# Altium project 4 laba.PrjPcb
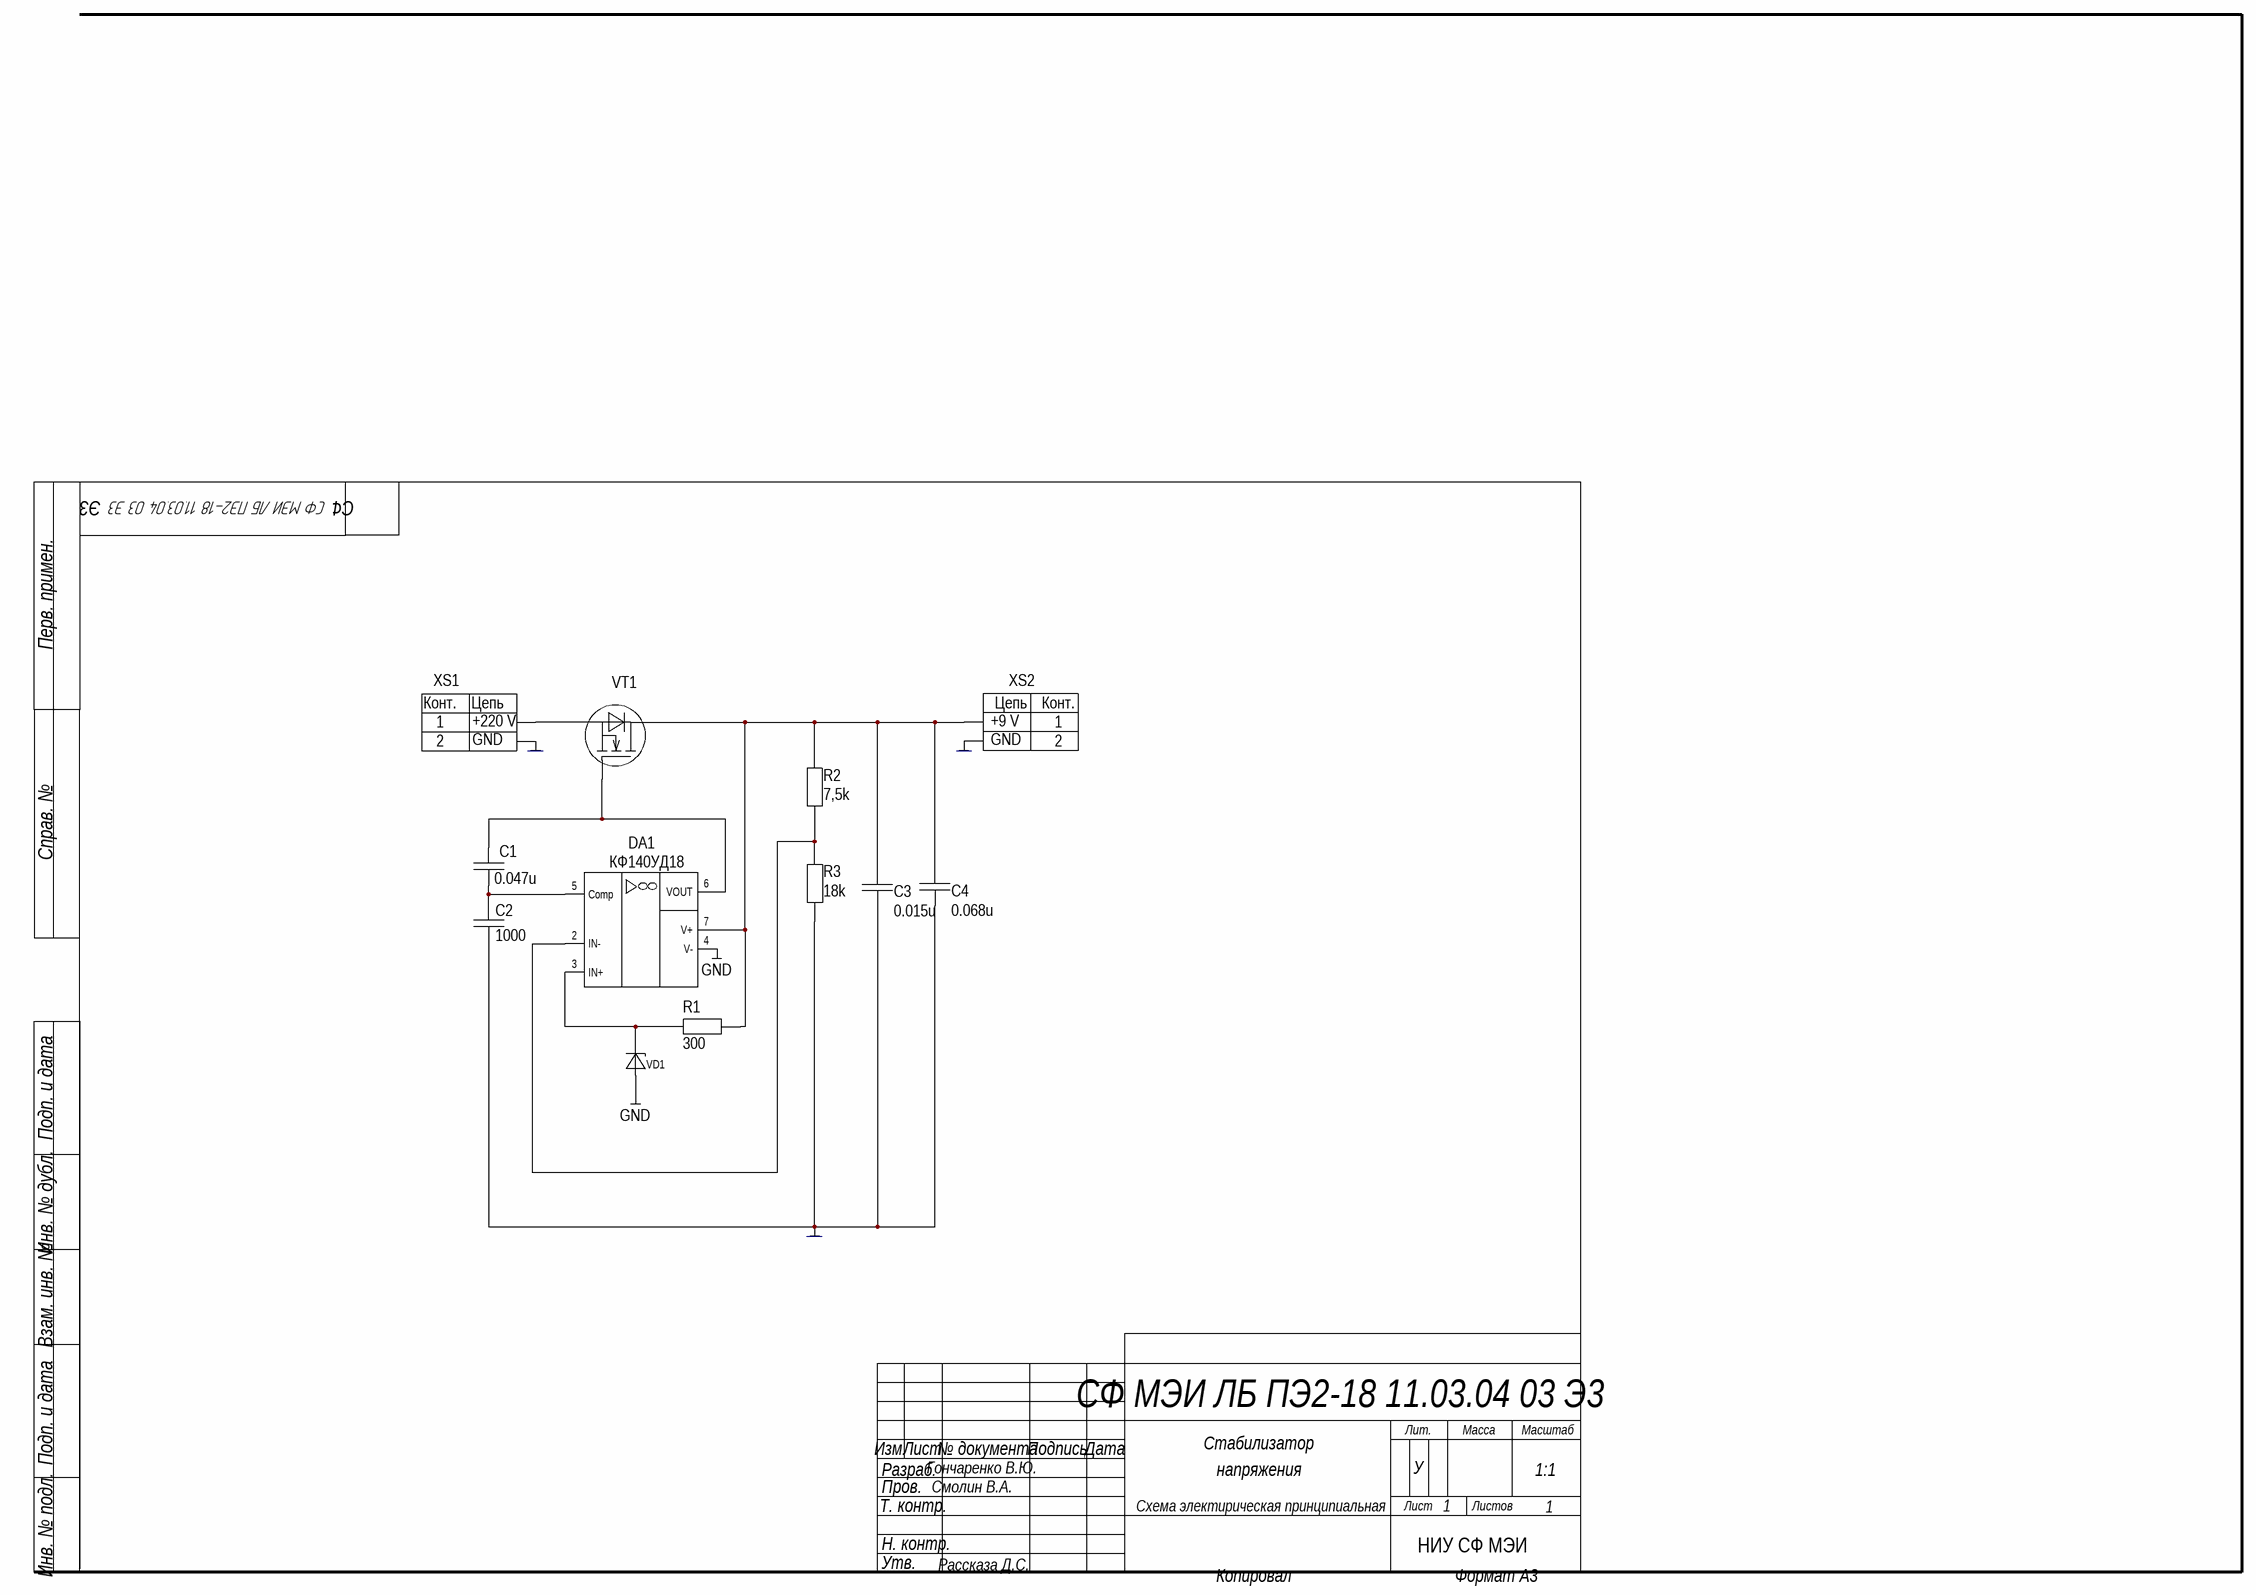
[diagram p0: СФ МЭИ ЛБ ПЭ2-18 11.03.04 03 Э3.SchDoc]
#NAME?: Гончаренко В.Ю.; Децимальный номер печатного узла: СФ МЭИ ЛБ ПЭ2-18 11.03.04 03; Компания: НИУ СФ МЭИ ПЭ2-18; Наименование: Стабилизатор Напряжения; Наименование1: Стабилизатор; Наименование2: Напряжения; Обозначение: СФ МЭИ ЛБ ПЭ2-18 11.03.04 03; Проверил: Смолин В.А.; Разработал: Гончаренко В.Ю.; Утвердил: Рассказа Д.С.
7 sheets, 12 parts. Net scope: global (net labels, ports and power ports of the same name join across sheets).
Board file: СФ МЭИ ЛБ ПЭ2-18 11.03.04 03.PcbDoc
Sheets:
  СФ МЭИ ЛБ ПЭ2-18 11.03.04 03 Э3.SchDoc
  Сборочный.SchDoc
  Плата печатная А3.SchDoc
  ДОРОГА а3.SchDoc
  з маски а3.SchDoc
  П МАСКИ а3.SchDoc
  верхний слой маркировки а3.SchDoc

## Sheet СФ МЭИ ЛБ ПЭ2-18 11.03.04 03 Э3.SchDoc
size 420 x 297 mm; Scale: 1:1; Разраб.: Гончаренко В.Ю.; Пров.: Смолин В.А.; Номер листа: 1; Общее количество листов: 1; Наименование изделия 1: Стабилизатор напряжения; Наименование изделия 2: Схема электрическая; Наименование изделия 3: принципиальная; Нач. отд.: Нач. отд.; Децимальный номер: СФ МЭИ ЛБ ПЭ2-18 11.03.04 03 Э3; Наименование. Строка 2: напряжения; Наименование. Строка 3: Схема электирическая принципиальная; Наименование. Строка 1: Стабилизатор; Разработал: Гончаренко В.Ю.; Проверил: Смолин В.А.; Утвердил: Рассказа Д.С.; Литера: У; Масштаб: 1:1; Лист. Номер: 1; Лист. Всего: 1

### Parts
C1  0.047u  [0805]
C2  1000  [0805]
C3  0.015u  [0805]
C4  0.068u  [0805]
DA1  КФ140УД18  [SOIC-8]
R1  300  [0805]
R2  7,5k  [0805]
R3  18k  [0805]
VD1  MMSZ5235B  [SOD-123]  (value not drawn)
VT1  IRLML2402TRPBF  [SOT23]  (value not drawn)
XS1  DG126-5.0-0.2P  [DG126-5.0-02P]  (value not drawn)
XS2  DG126-5.0-0.2P  [DG126-5.0-02P]  (value not drawn)

### Nets
GND: DA1.4(V-) VD1.1(In)
NetC2_1: C2.1 C3.2 C4.1 R3.1 XS1.2(Pin2) XS2.2(Pin2)
NetC1_1: C1.1 C2.2 DA1.5(Comp)
NetC1_2: C1.2 DA1.6(VOUT) VT1.1(G)
NetC3_1: C3.1 C4.2 DA1.7(V+) R1.2 R2.2 VT1.3(D) XS2.1(Pin1)
NetDA1_2: DA1.2(IN-) R2.1 R3.2
NetDA1_3: DA1.3(IN+) R1.1 VD1.2(Out)
NetVT1_2: VT1.2(S) XS1.1(Pin1)

### Notes on the sheet
- (near XS1) +220 V
- (near XS2) +9 V
- (near XS1) GND
- (near XS2) GND
- НИУ СФ МЭИ ПЭ2-18
- Перв. примен.
- Справ. №
- Подп. и дата
- Инв. № дубл.
- Взам. инв. №
- Разраб.
- Изм.
- Лист
- № документа
- Подпись
- Дата
- Лит.
- Масса
- Масштаб
- Т. контр.
- Пров.
- Листов
- Инв. № подл.
- Н. контр.
- Утв.
- Копировал
- Формат A3
- (in symbol DG126-5.0-0.2P) Конт.; Цепь

### Library data of the parts
C1 = К53-68"R"-25В-0.047 мкФ ±10% 0805_3: К53-68"R"-25В-0.047 мкФ ±10%
C2 = К53-68"R"-25В-1000 пФ ±10% 0805_2: К53-68"R"-25В-1000 пФ ±10%
C3 = К53-68"R"-25В-0.015 мкФ ±10% 0805_1: К53-68"R"-25В-0.015 мкФ ±10%
C4 = К53-68"R"-25В-0.068 мкФ ±10% 0805: К53-68"R"-25В-0.068 мкФ ±10%
R1 = 0.125Вт 0805 300 Ом, 5%, Чип резистор (SMD): 0805-0.125 Вт -300 Ом±5%
R2 = 0.125Вт 0805 7,5 кОм, 5%, Чип резистор (SMD): 0805-0.125 Вт -7,5 кОм±5%
R3 = 0.125Вт 0805 18 кОм, 5%, Чип резистор (SMD): 0805-0.125 Вт -18 кОм±5%
VT1 = IRLML2402TRPBF: SI2304DDS-T1-GE3

## Sheet Сборочный.SchDoc
size 594 x 420 mm; Scale: 1:1; Разраб.: Гончаренко В.Ю.; Пров.: Смолин В.А.; Номер листа: 1; Общее количество листов: 1; Наименование изделия 1: Цифровой автомат; Наименование изделия 2: Сборочный чертеж; Нач. отд.: Нач. отд.; Децимальный номер: СФ МЭИ КР ПЭ2-18 11.03.04 03 СБ; Наименование. Строка 2: Автомат; Наименование. Строка 3: Сборочный чертёж; Наименование. Строка 1: Циффровой; Разработал: Гончаренко В.Ю.; Проверил: Смолин В.А.; Утвердил: Рассказа Д.С.; Литера: У; Масштаб: 3.5:1; Лист. Номер: 1; Лист. Всего: 1
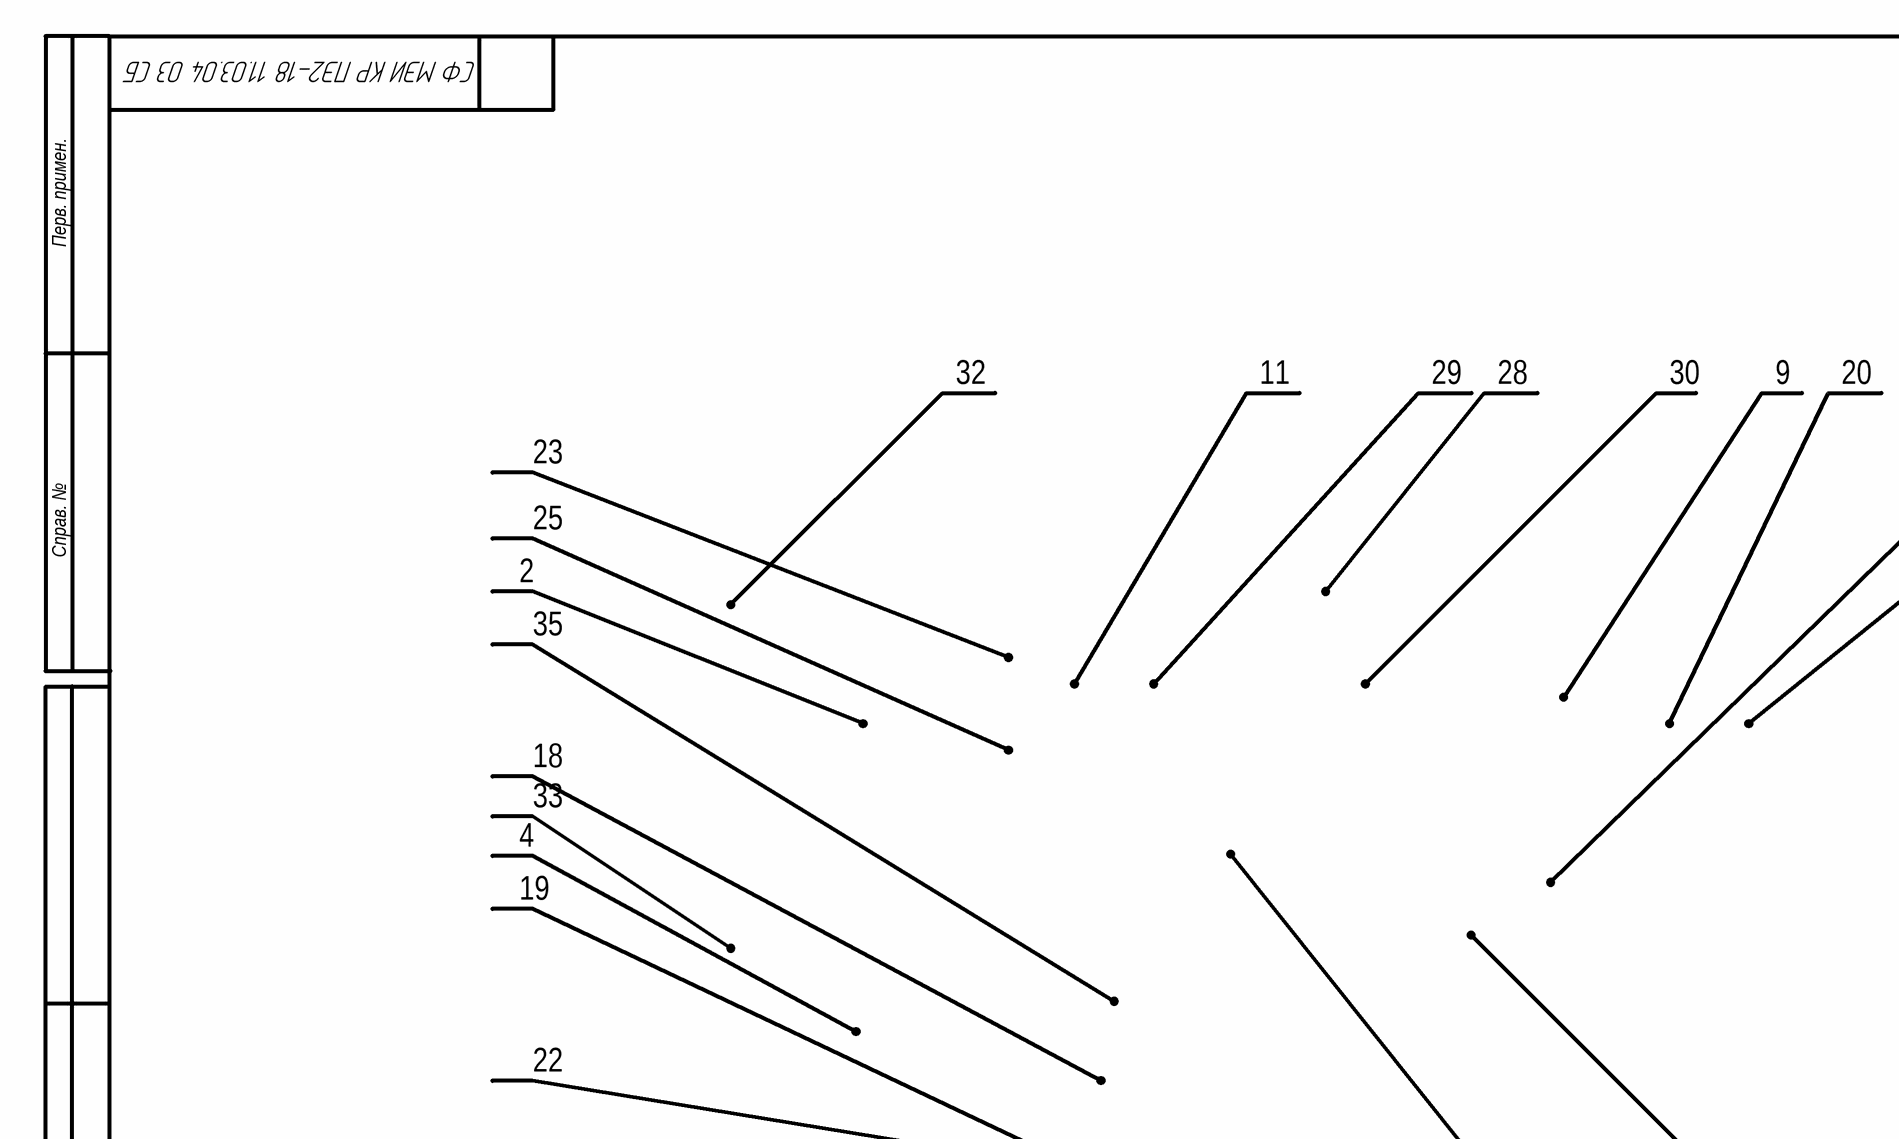
[diagram p1: Сборочный.SchDoc, top left]
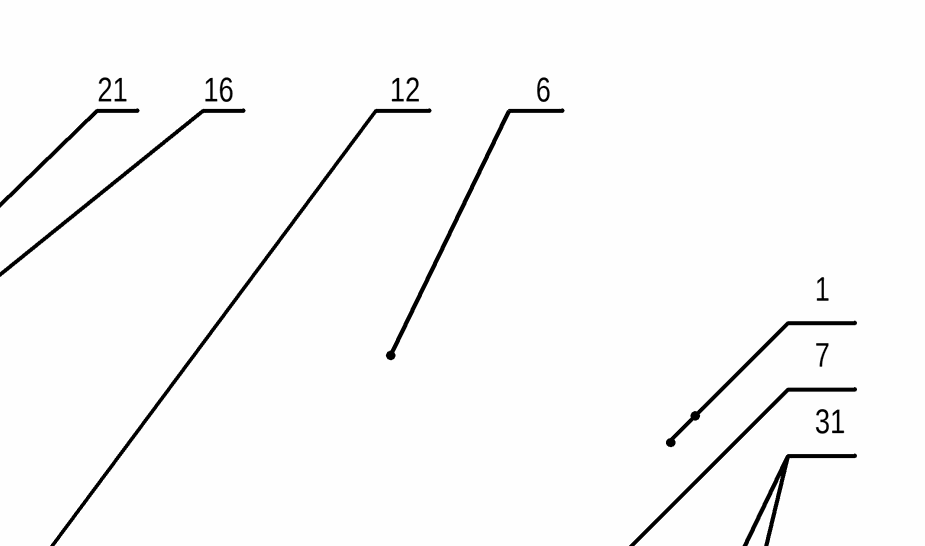
[diagram p2: Сборочный.SchDoc, top right]
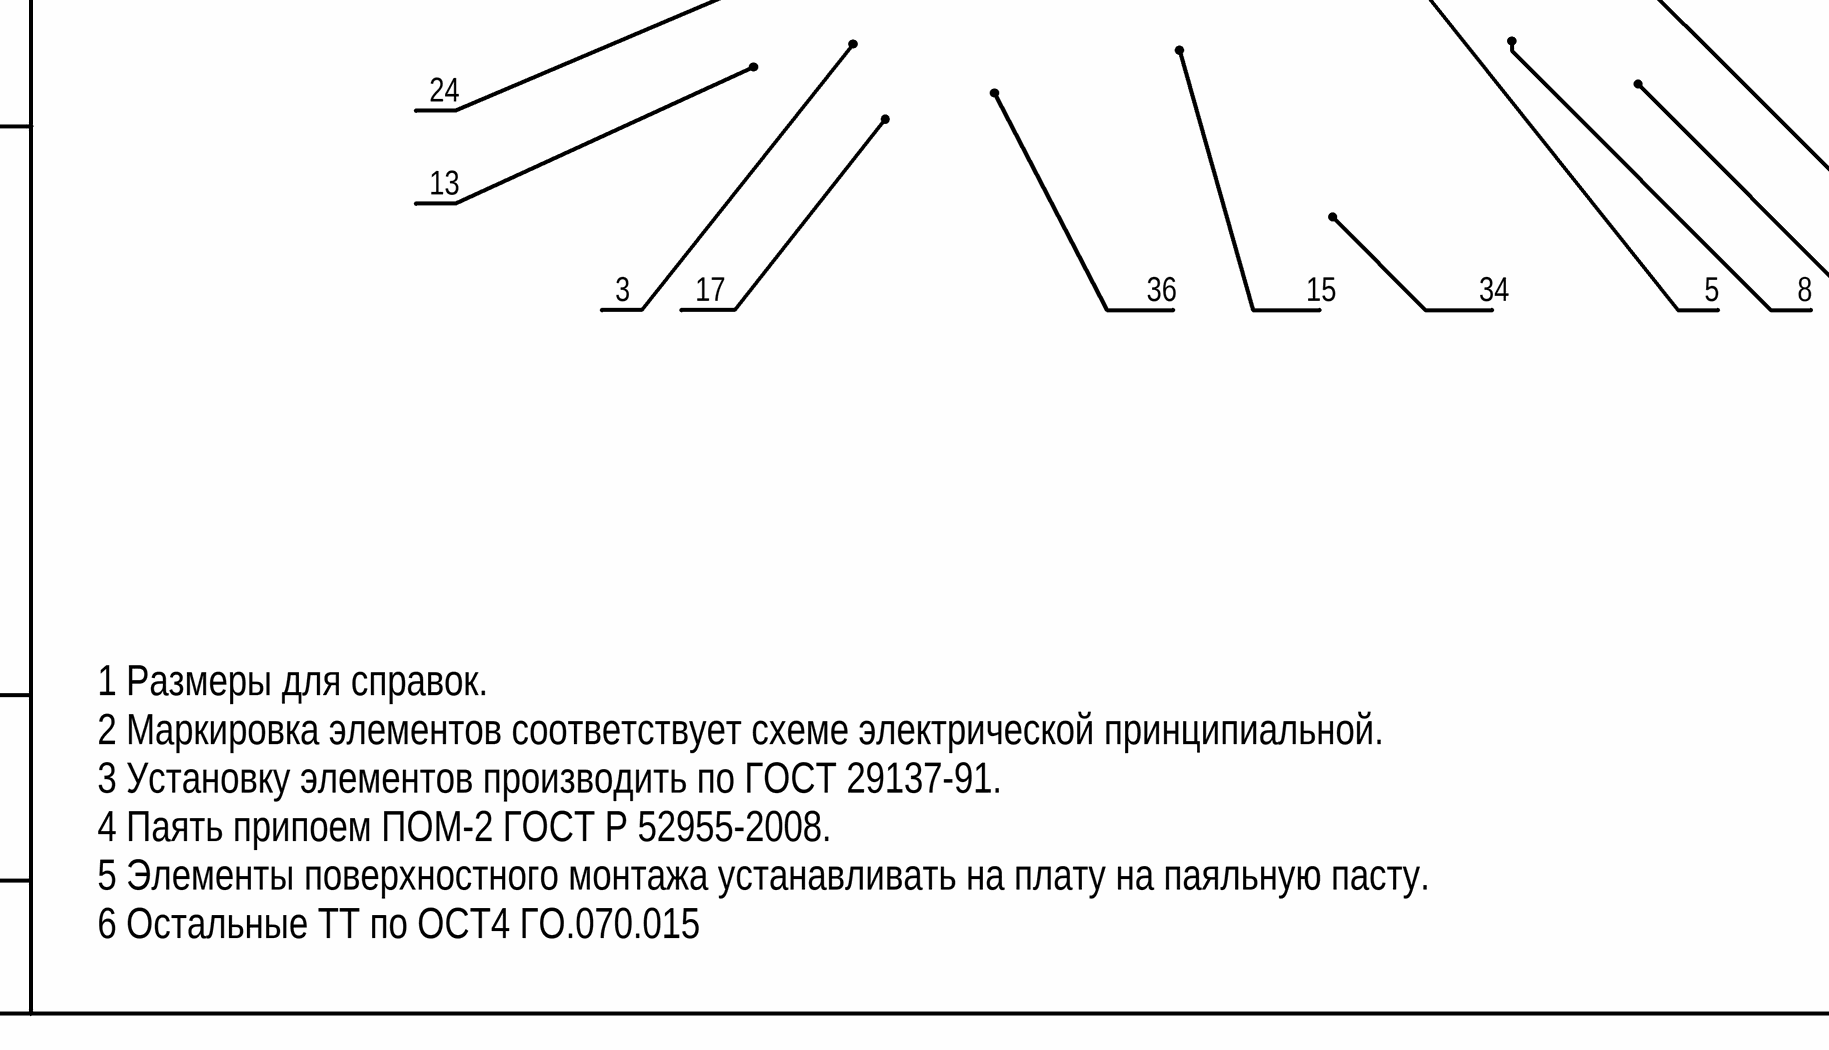
[diagram p3: Сборочный.SchDoc, bottom left]
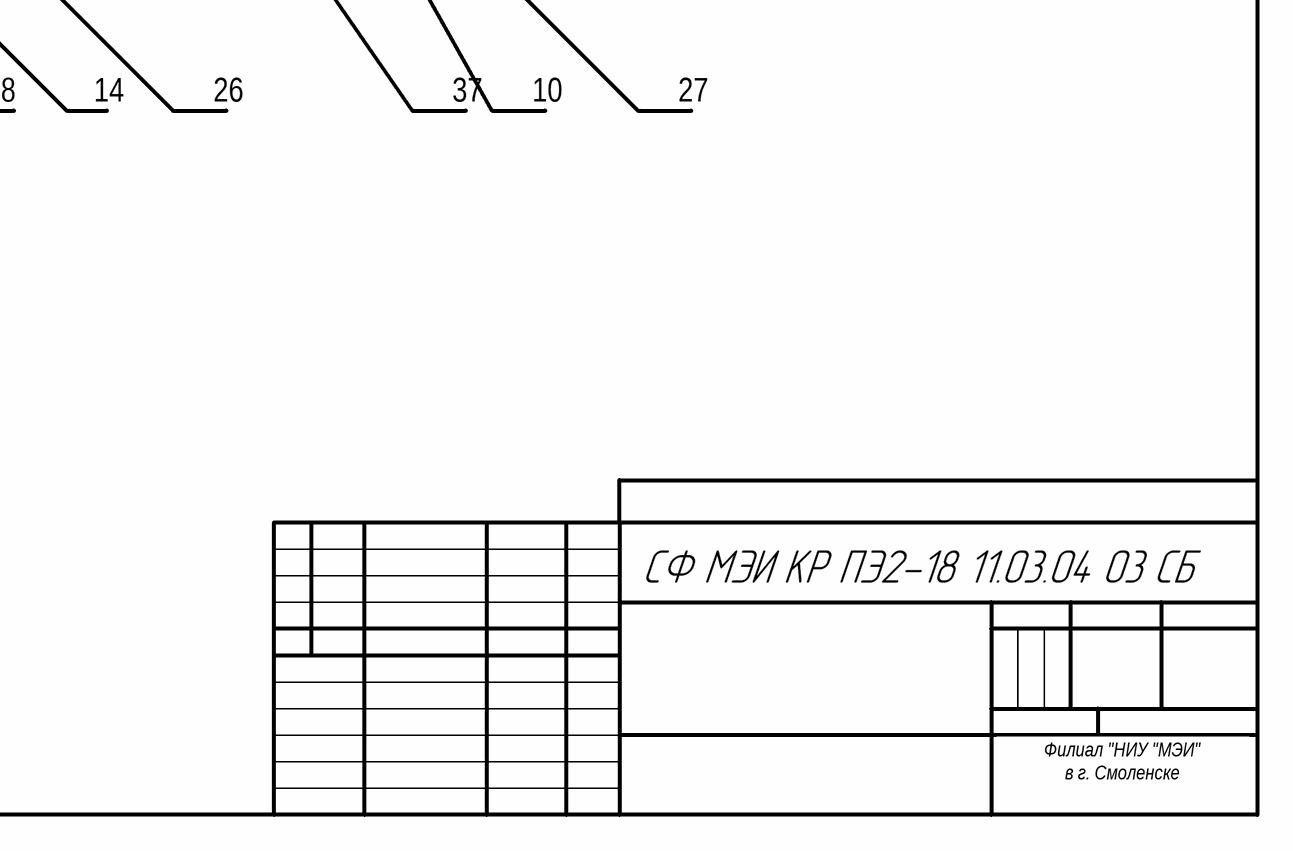
[diagram p4: Сборочный.SchDoc, bottom right]

### Notes on the sheet
- Перв. примен.
- 32
- 11
- 29
- 28
- 30
- 9
- 20
- 21
- 16
- 12
- 6
- 23
- Справ. №
- 25
- 2
- 35
- 1
- 7
- 18
- 31
- 33
- 4
- 19
- 22
- 24
- 13
- 3
- 17
- 36
- 15
- 34
- 5
- 8
- 14
- 26
- 37
- 10
- 27
- 1 Размеры для справок.
  2 Маркировка элементов соответствует схеме электрической принципиальной.
  3 Установку элементов производить по ГОСТ 29137-91.
  4 Паять припоем ПОМ-2 ГОСТ Р 52955-2008.
  5 Элементы поверхностного монтажа устанавливать на плату на паяльную пасту.
  6 Остальные ТТ по ОСТ4 ГО.070.015
- Филиал "НИУ "МЭИ"
  в г. Смоленске
  ПЭ2-18
- Разработал. Дата
- Подп. и дата
- Инв. № дубл.
- Взам. инв. №
- Разраб.
- Изм.
- Лист
- № документа
- Подпись
- Дата
- Лит.
- Масса
- Масштаб
- Т. контр.
- Пров.
- Листов
- Инв. № подл.
- Н. контр.
- Утв.
- Копировал
- Формат A2

## Sheet Плата печатная А3.SchDoc
size 420 x 297 mm; Scale: 1:1; Разраб.: Гончаренко В.Ю.; Пров.: Смолин В.А.; Номер листа: 1; Общее количество листов: 5; Децимальный номер: СФ МЭИ КР ПЭ2-18 11.03.04 03; Разработал: Гончаренко В.Ю.; Проверил: Смолин В.А.; Литера: У; Масштаб: 2:1; Лист. Номер: 1
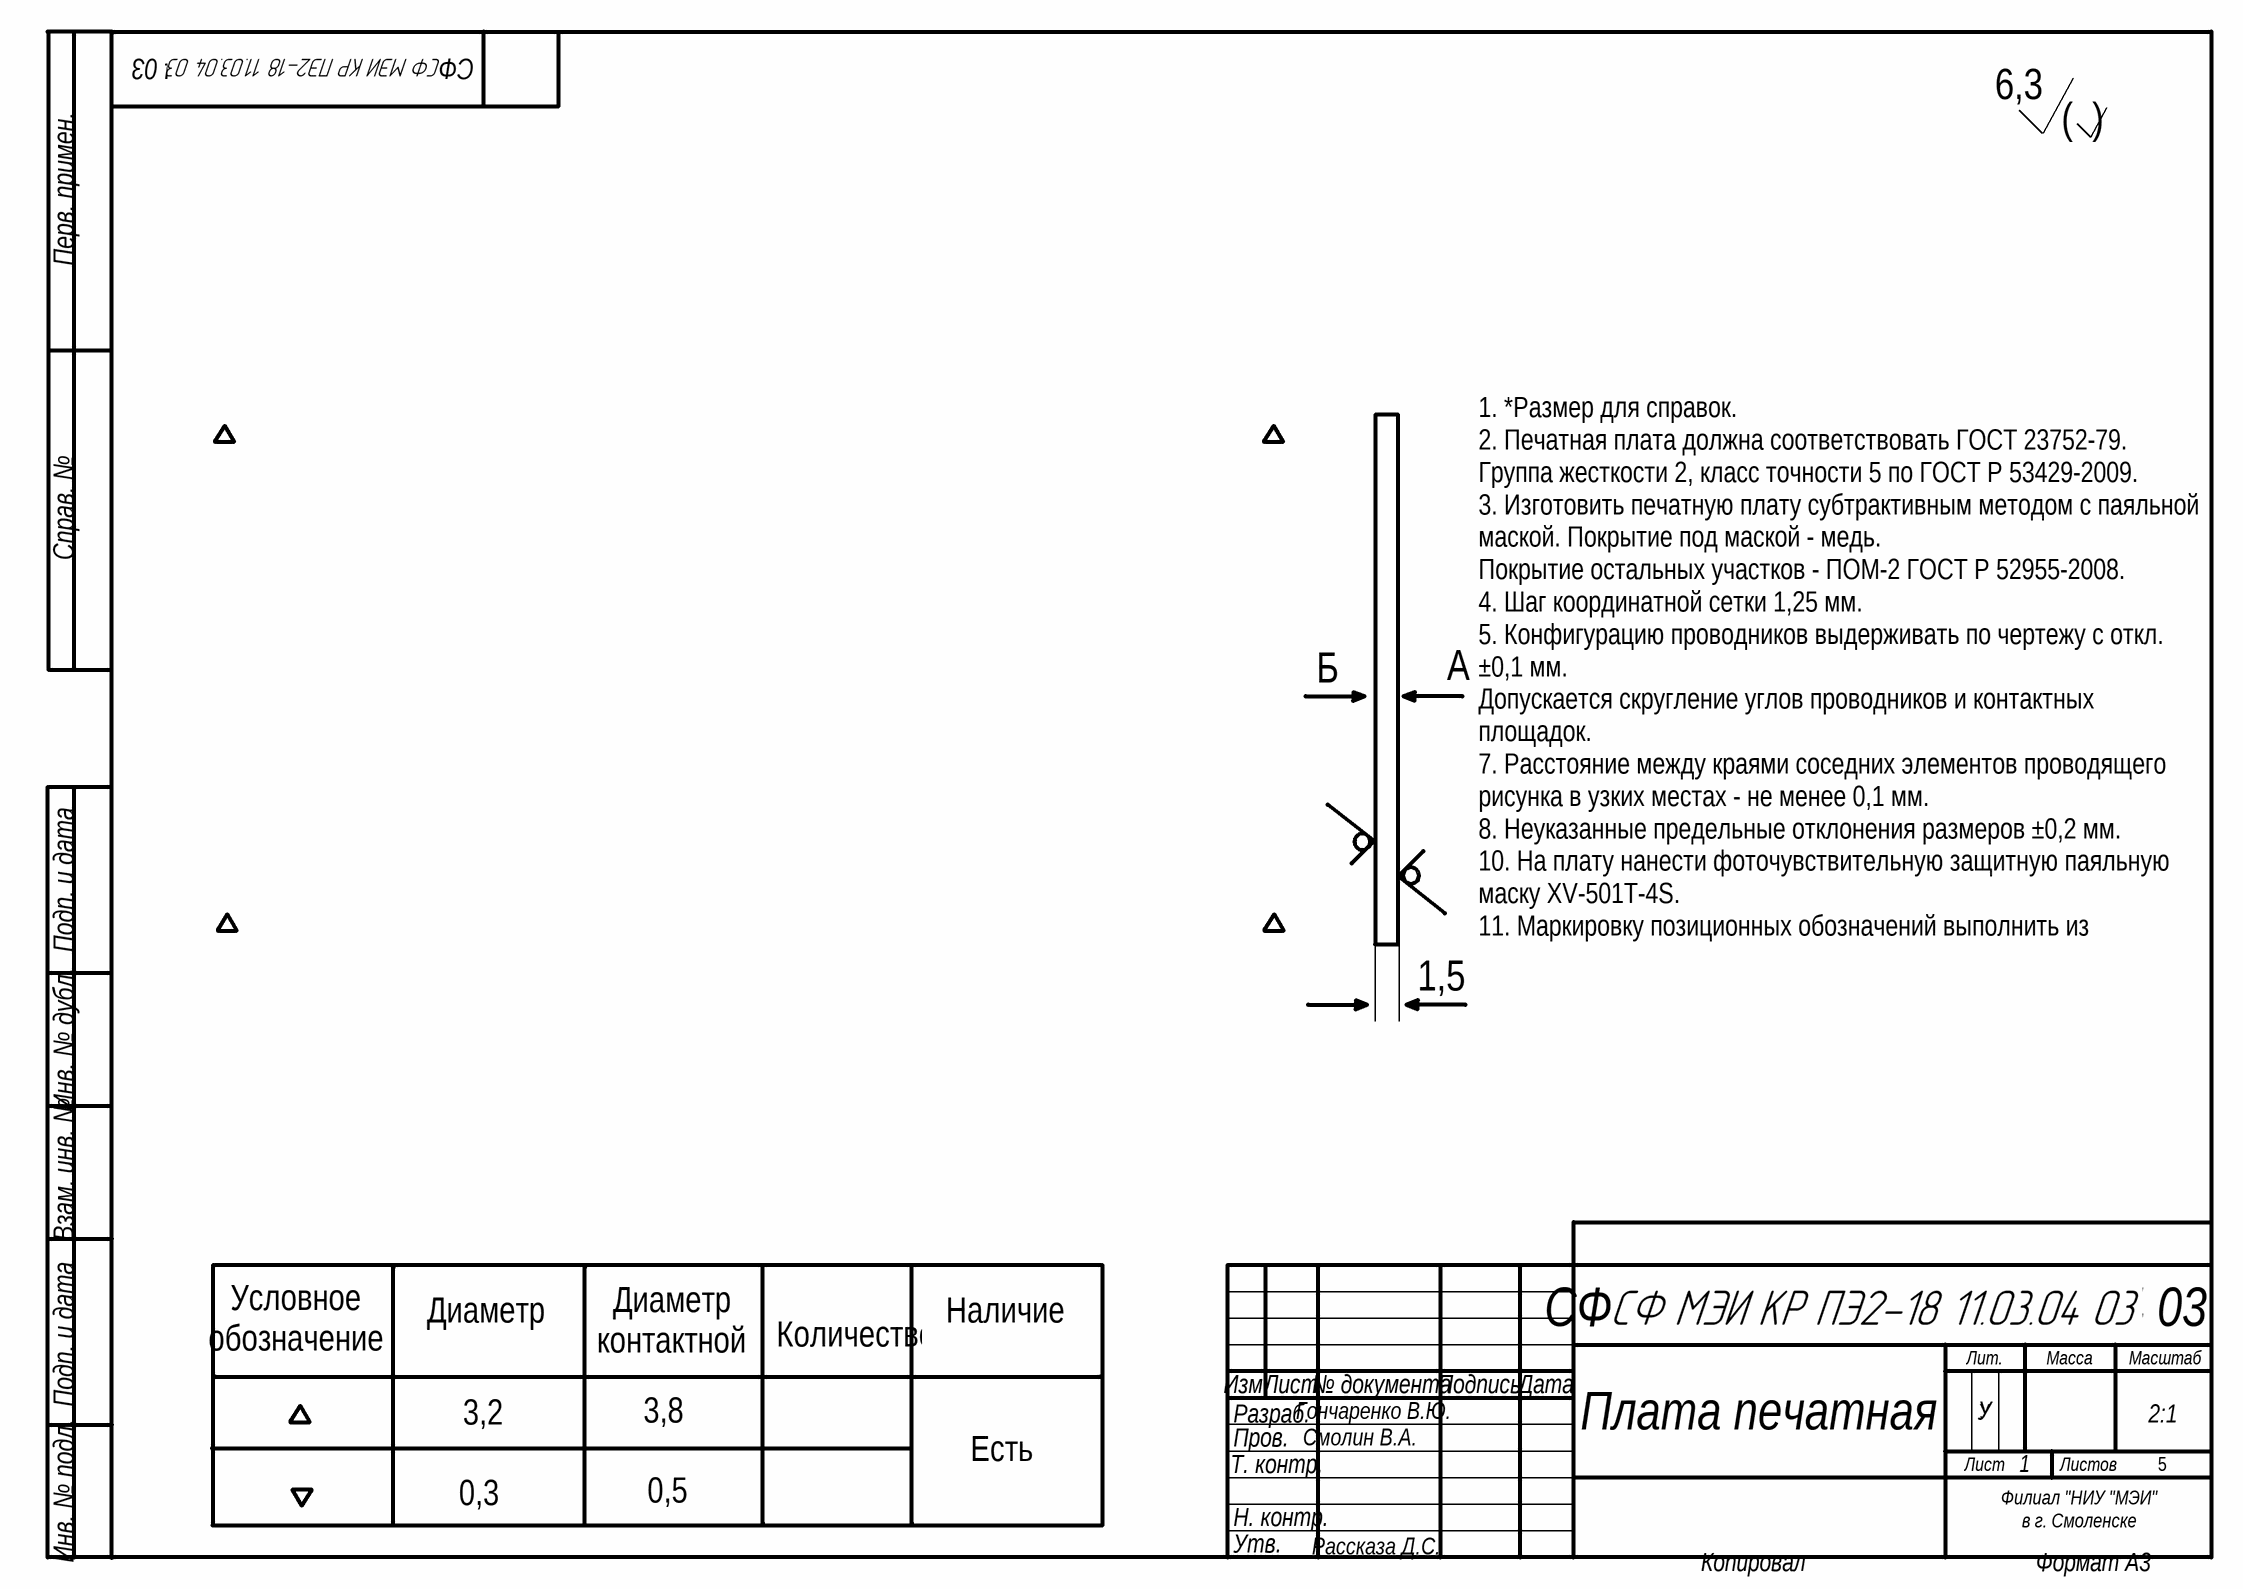
[diagram p5: Плата печатная А3.SchDoc]

### Notes on the sheet
- 6,3
- (  )
- Б
- А
- 1,5
- 1. *Размер для справок.
  2. Печатная плата должна соответствовать ГОСТ 23752-79.
  Группа жесткости 2, класс точности 5 по ГОСТ Р 53429-2009.
  3. Изготовить печатную плату субтрактивным методом с паяльной маской. Покрытие под маской - медь.
  Покрытие остальных участков - ПОМ-2 ГОСТ Р 52955-2008.
  4. Шаг координатной сетки 1,25 мм.
  5. Конфигурацию проводников выдерживать по чертежу с откл. ±0,1 мм.
  Допускается скругление углов проводников и контактных площадок.
  7. Расстояние между краями соседних элементов проводящего рисунка в узких местах - не менее 0,1 мм.
  8. Неуказанные предельные отклонения размеров ±0,2 мм.
  10. На плату нанести фоточувствительную защитную паяльную маску XV-501T-4S.
  11. Маркировку позиционных обозначений выполнить из диэлектрического материала. Шрифт 2-Пр3 ГОСТ 26.020-80.
- Условное
  обозначение
  отверстия
- Диаметр
  отверстия,мм
- Диаметр
  контактной
  площадки,мм
- Количество
- Наличие
  металлизации
- Плата печатная
- 3,2
- 3,8
- 4
- Есть
- 0,3
- 0,5
- 63
- Филиал "НИУ "МЭИ"
  в г. Смоленске
  ПЭ2-18
- Перв. примен.
- Справ. №
- Подп. и дата
- Инв. № дубл.
- Взам. инв. №
- Разраб.
- Изм.
- Лист
- № документа
- Подпись
- Дата
- Лит.
- Масса
- Масштаб
- Т. контр.
- Пров.
- Листов
- Инв. № подл.
- Н. контр.
- Утв.
- Копировал
- Формат A3

## Sheet ДОРОГА а3.SchDoc
size 420 x 297 mm; Address1: Address1; Address2: Address2; Address3: Address3; Address4: Address4; SheetNumber: 1; Scale: 1:1; Обозначение документа: СФ МЭИ КР ПЭ2-18 11.03.04 02; Номер листа: 5
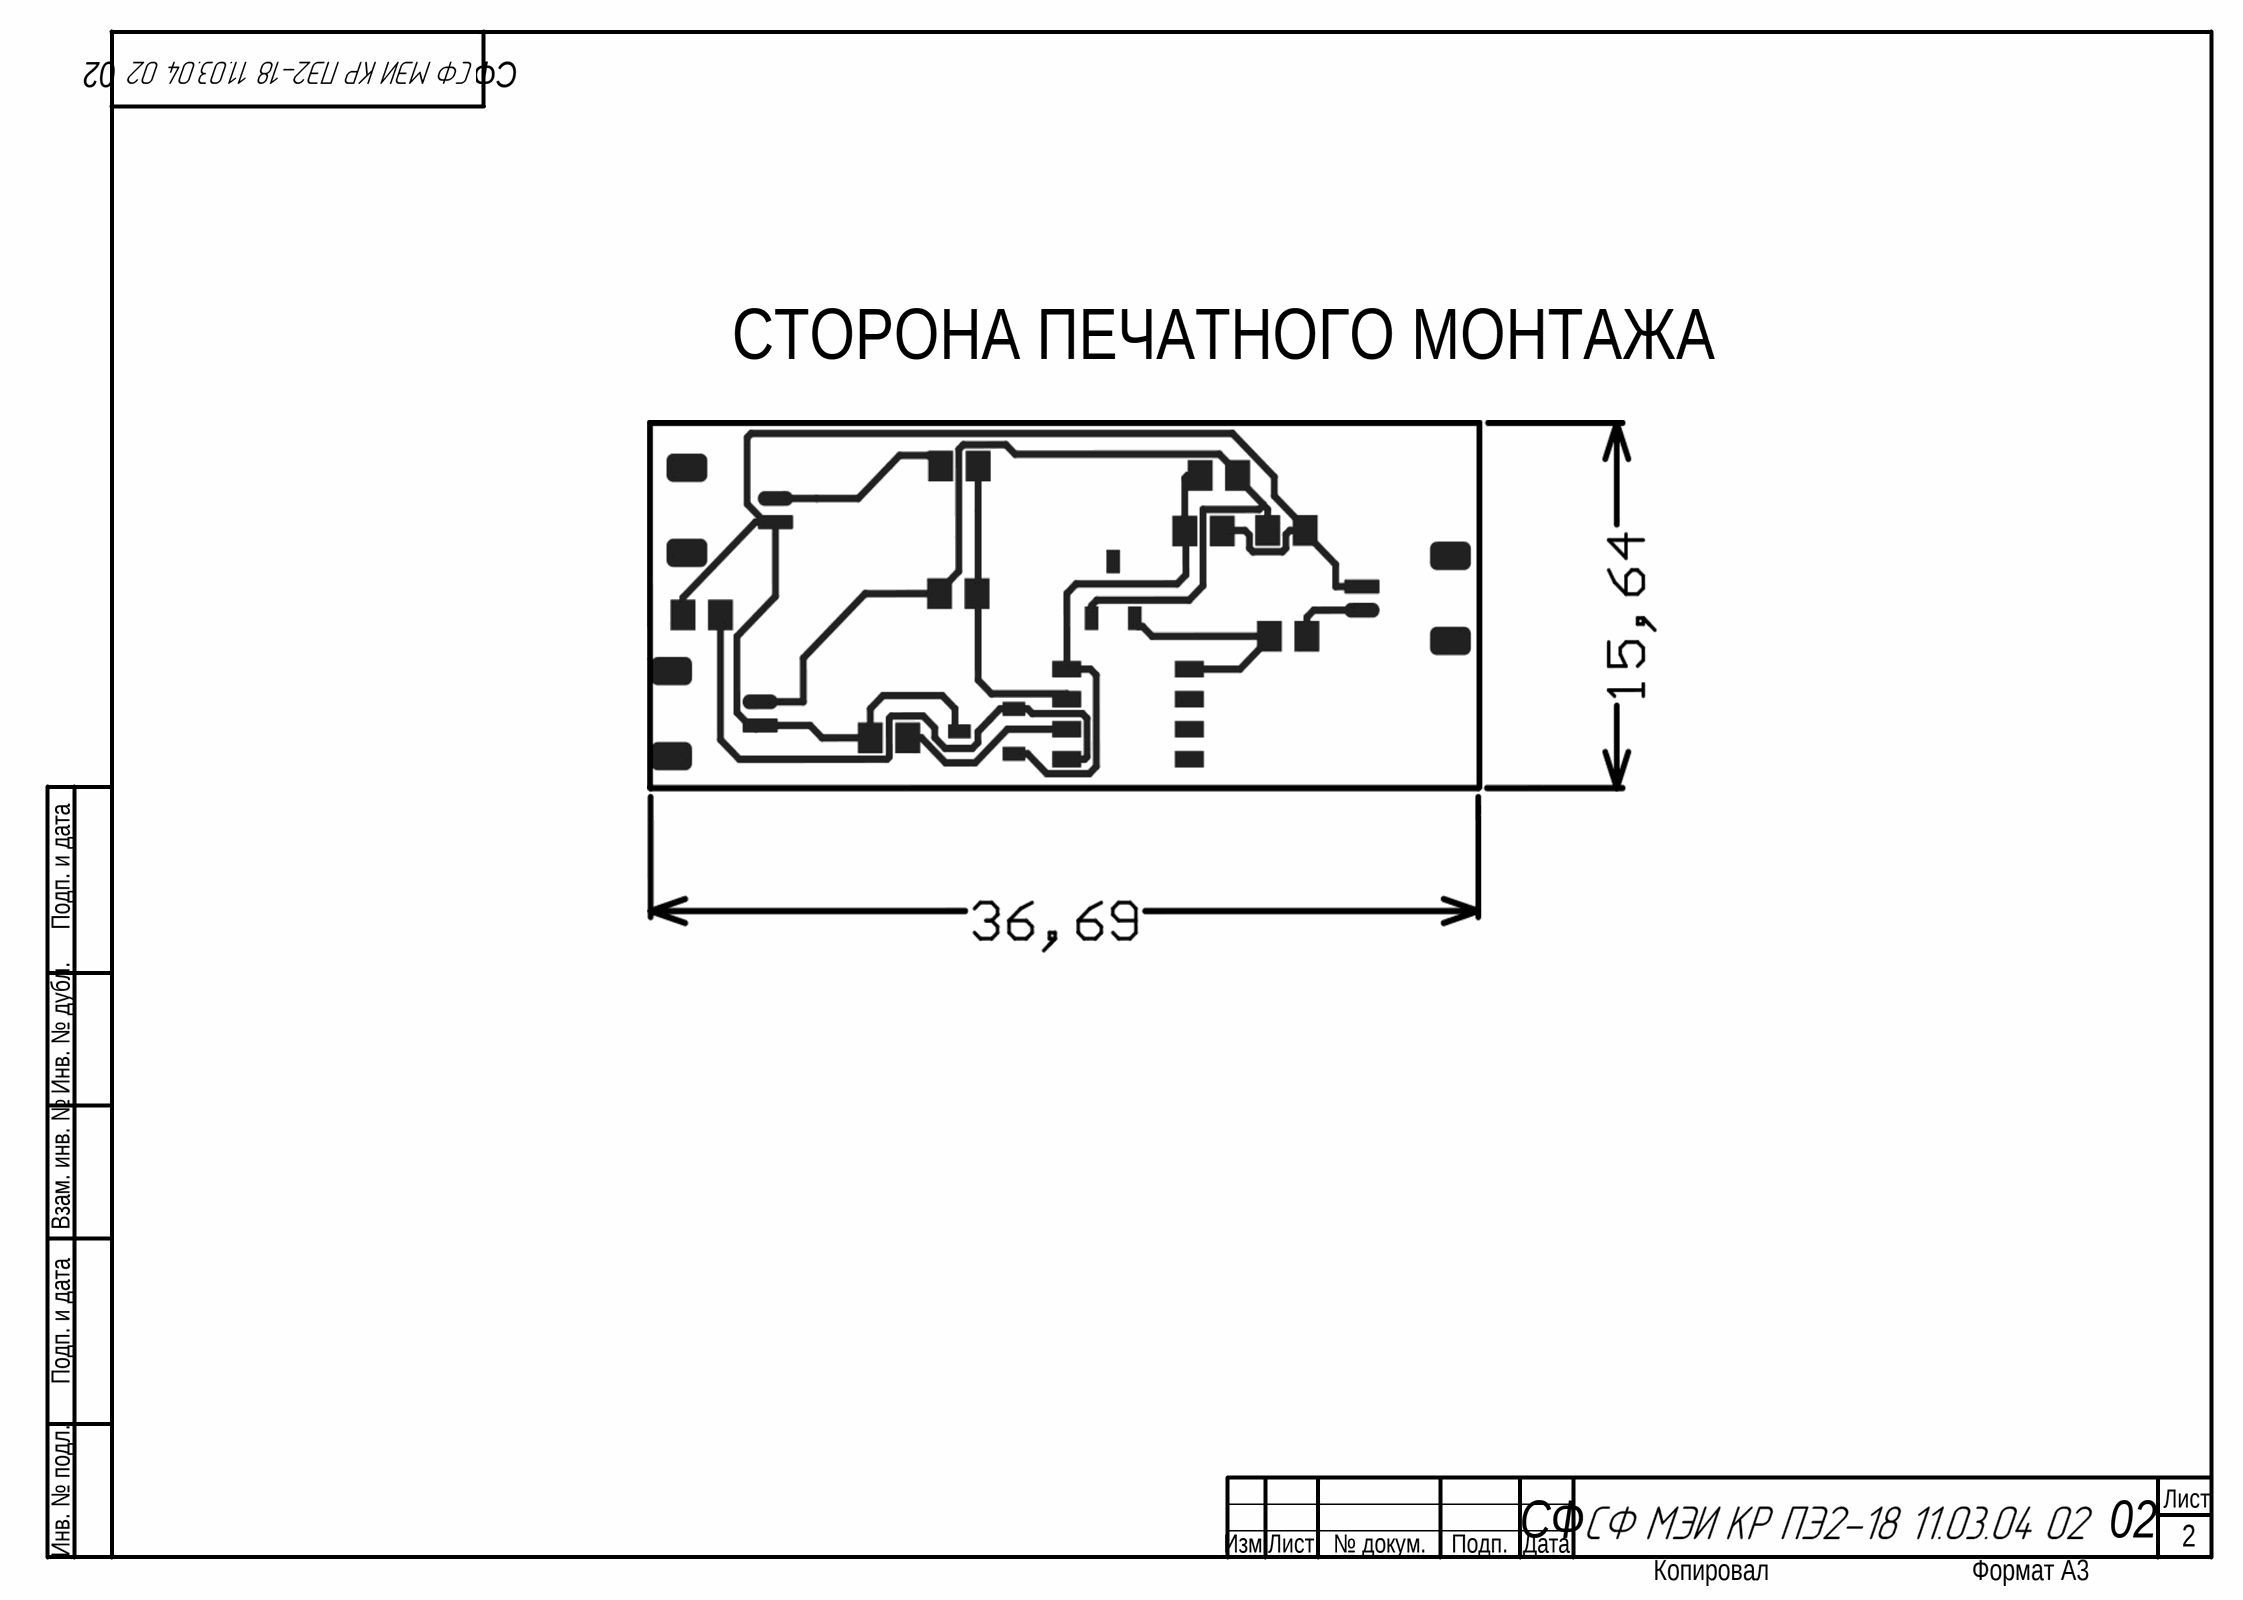
[diagram p6: ДОРОГА а3.SchDoc]

### Notes on the sheet
- СТОРОНА ПЕЧАТНОГО МОНТАЖА
- Б
- Подп. и дата
- Инв. № дубл.
- Взам. инв. №
- Инв. № подл.
- Изм.
- Лист
- № докум.
- Подп.
- Дата
- 2
- Копировал
- Формат А3

## Sheet з маски а3.SchDoc
size 420 x 297 mm; Address1: Address1; Address2: Address2; Address3: Address3; Address4: Address4; SheetNumber: 1; Scale: 1:1; Номер листа: 5
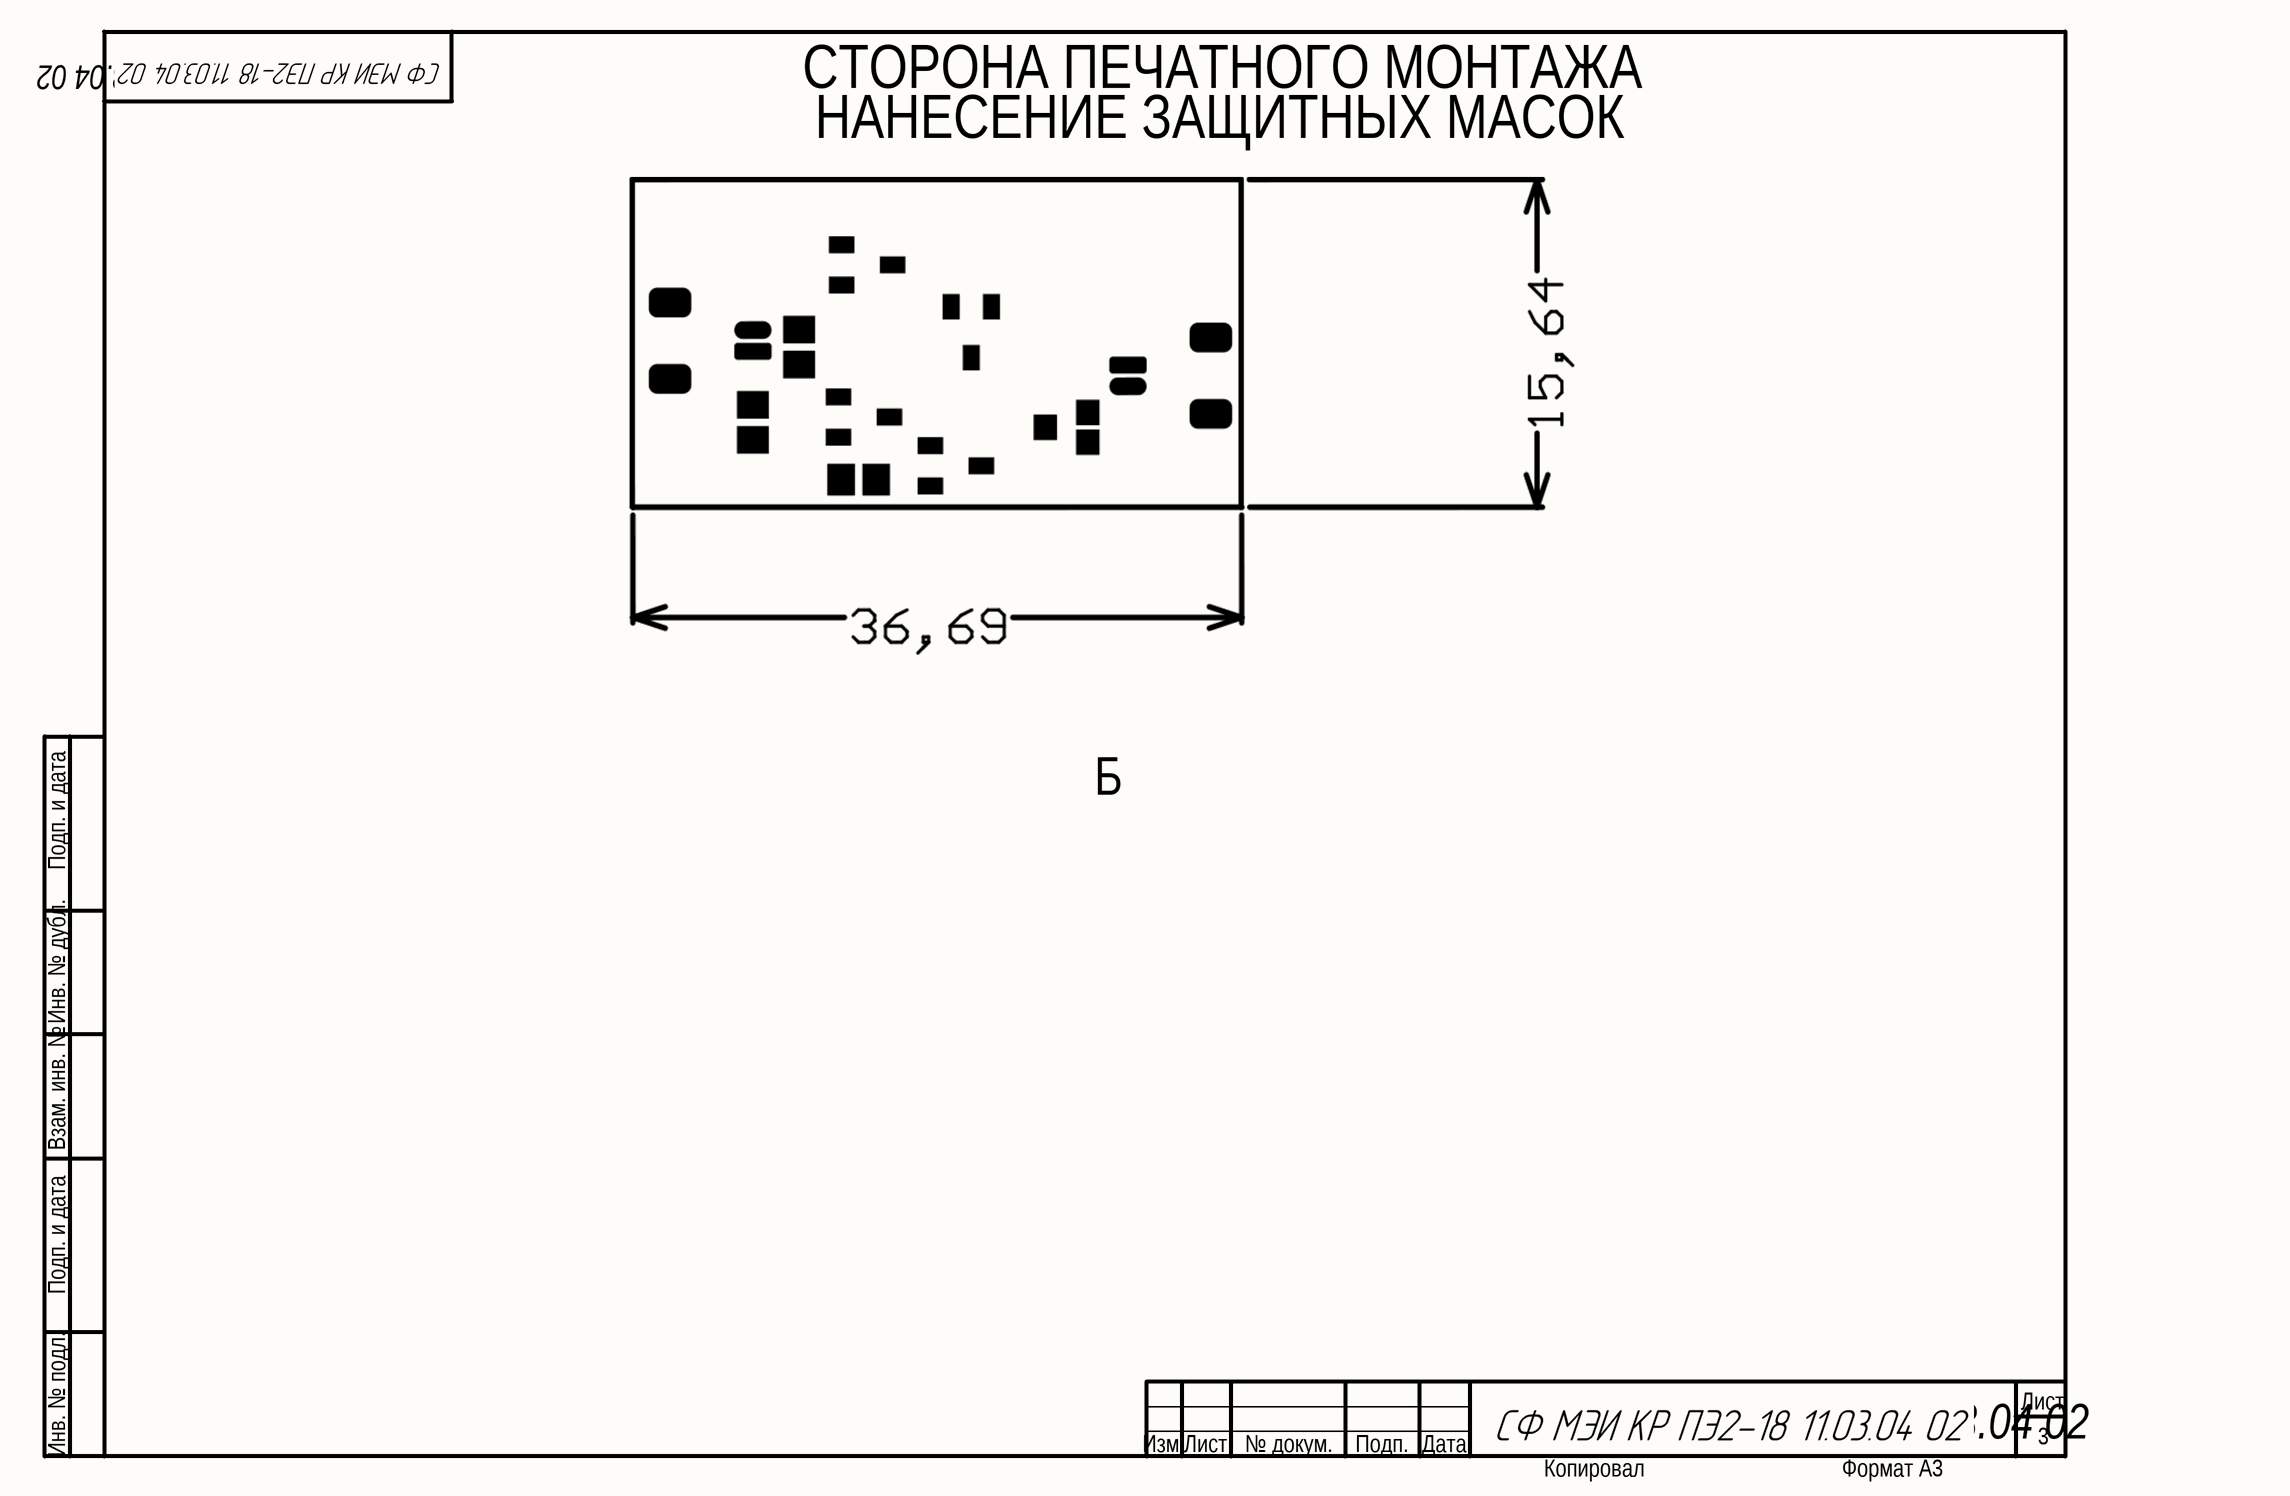
[diagram p7: з маски а3.SchDoc]

### Notes on the sheet
- СФ МЭИ КР ПЭ2-18 11.03.04 02
- СТОРОНА ПЕЧАТНОГО МОНТАЖА
- НАНЕСЕНИЕ ЗАЩИТНЫХ МАСОК
- Б
- Подп. и дата
- Инв. № дубл.
- Взам. инв. №
- Инв. № подл.
- Изм.
- Лист
- № докум.
- Подп.
- Дата
- 3
- Копировал
- Формат А3

## Sheet П МАСКИ а3.SchDoc
size 420 x 297 mm; Address1: Address1; Address2: Address2; Address3: Address3; Address4: Address4; SheetNumber: 1; Scale: 1:1; Номер листа: 5
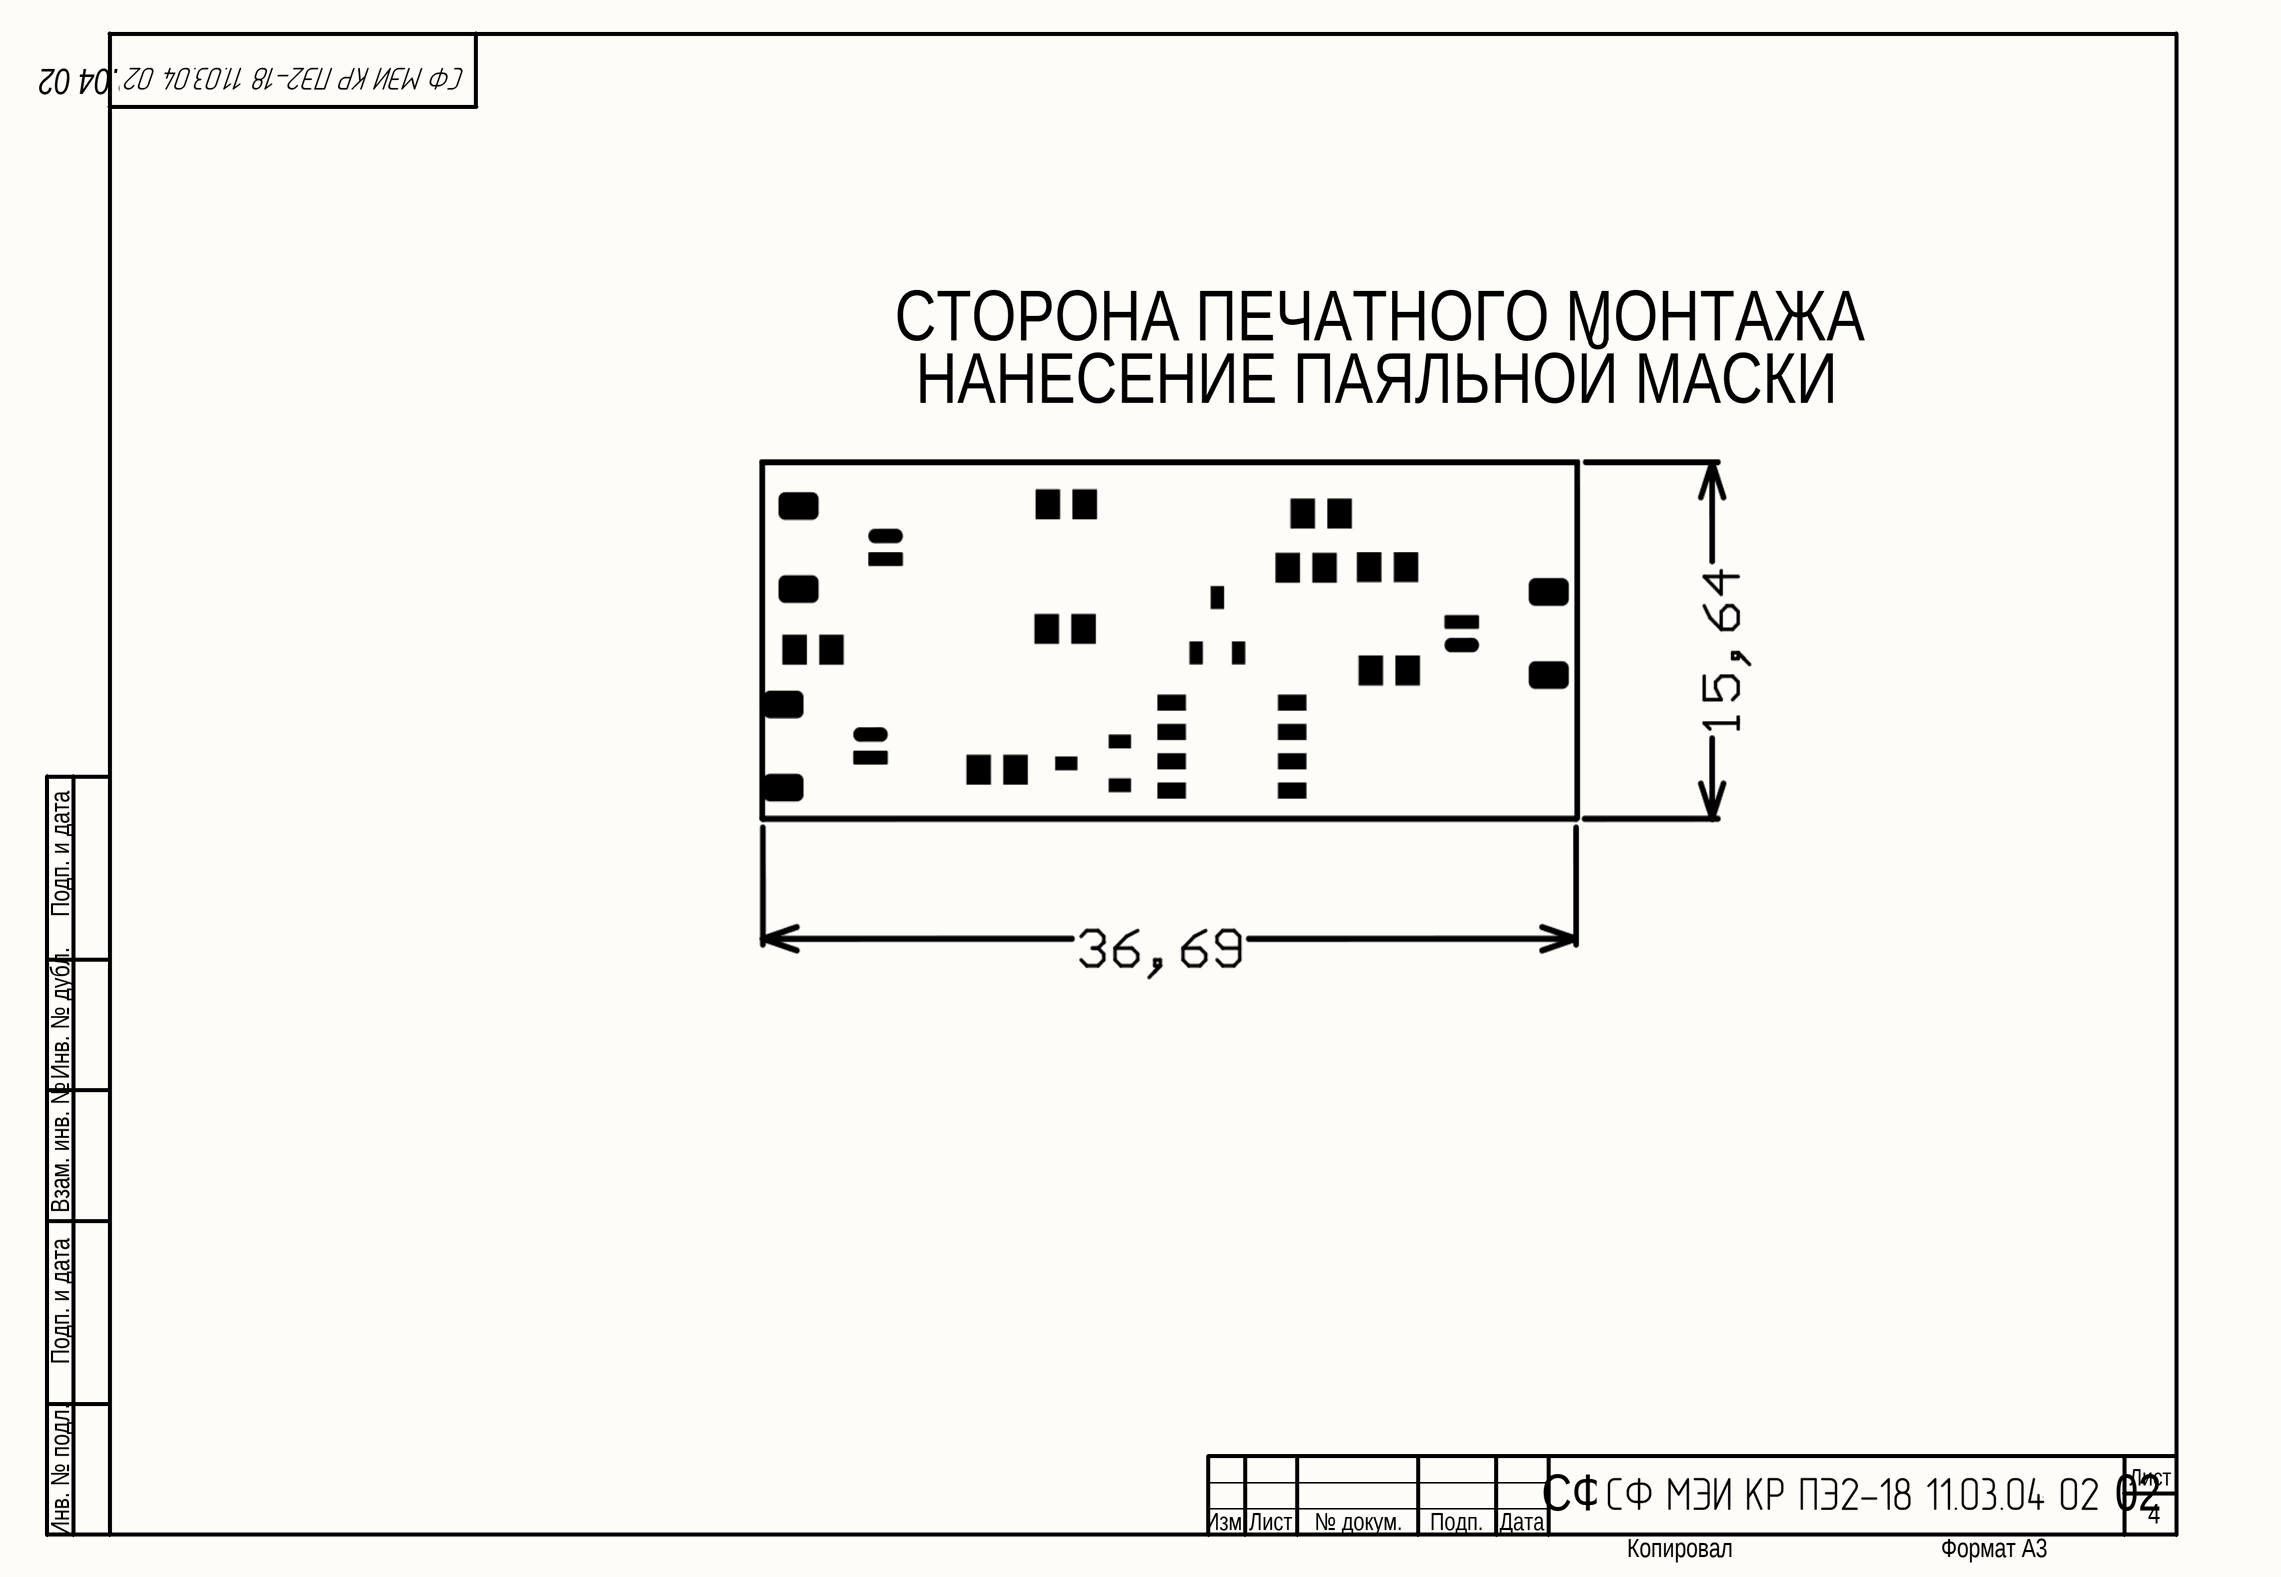
[diagram p8: П МАСКИ а3.SchDoc]

### Notes on the sheet
- СФ МЭИ КР ПЭ2-18 11.03.04 02
- СТОРОНА ПЕЧАТНОГО МОНТАЖА
- НАНЕСЕНИЕ ПАЯЛЬНОЙ МАСКИ
- Подп. и дата
- Инв. № дубл.
- Взам. инв. №
- Инв. № подл.
- Изм.
- Лист
- № докум.
- Подп.
- Дата
- .
- 4
- Копировал
- Формат А3

## Sheet верхний слой маркировки а3.SchDoc
size 420 x 297 mm; Address1: Address1; Address2: Address2; Address3: Address3; Address4: Address4; SheetNumber: 1; Scale: 1:1; Номер листа: 5
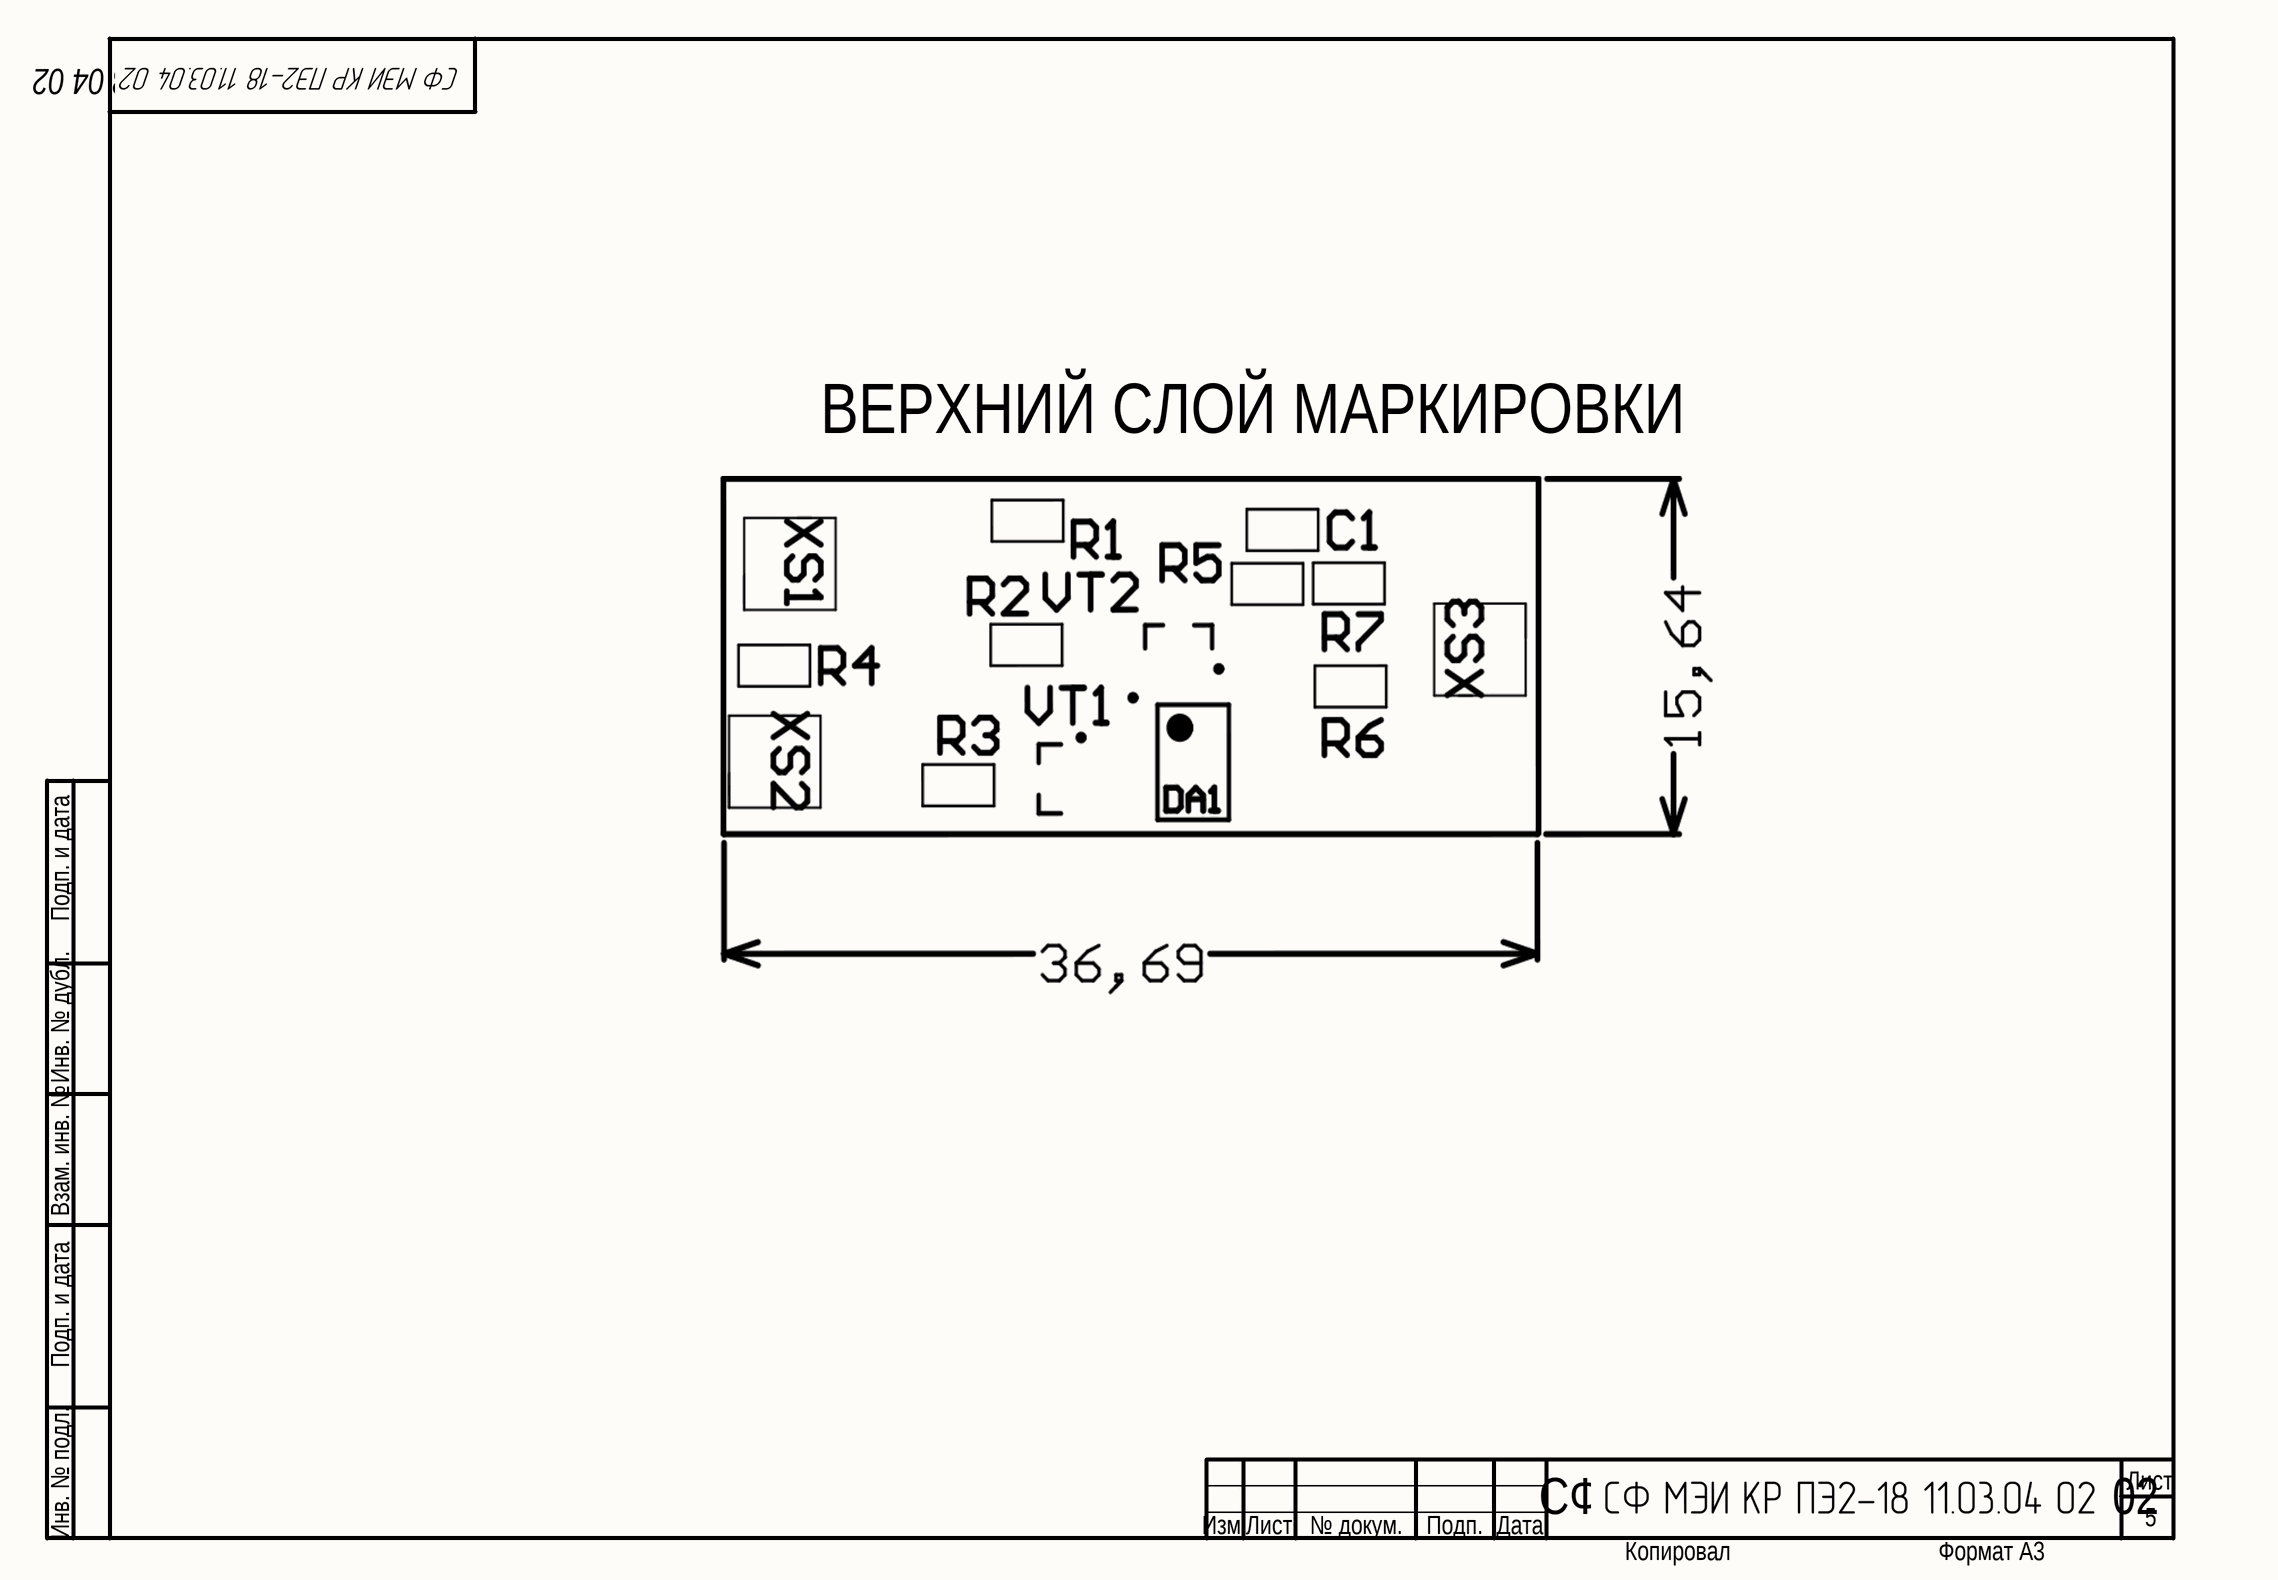
[diagram p9: верхний слой маркировки а3.SchDoc]

### Notes on the sheet
- СФ МЭИ КР ПЭ2-18 11.03.04 02
- ВЕРХНИЙ СЛОЙ МАРКИРОВКИ
- Подп. и дата
- Инв. № дубл.
- Взам. инв. №
- Инв. № подл.
- Изм.
- Лист
- № докум.
- Подп.
- Дата
- .
- Копировал
- Формат А3